# EAGLE schematic MSSRP-Microcontroller (EAGLE 6.6.0)
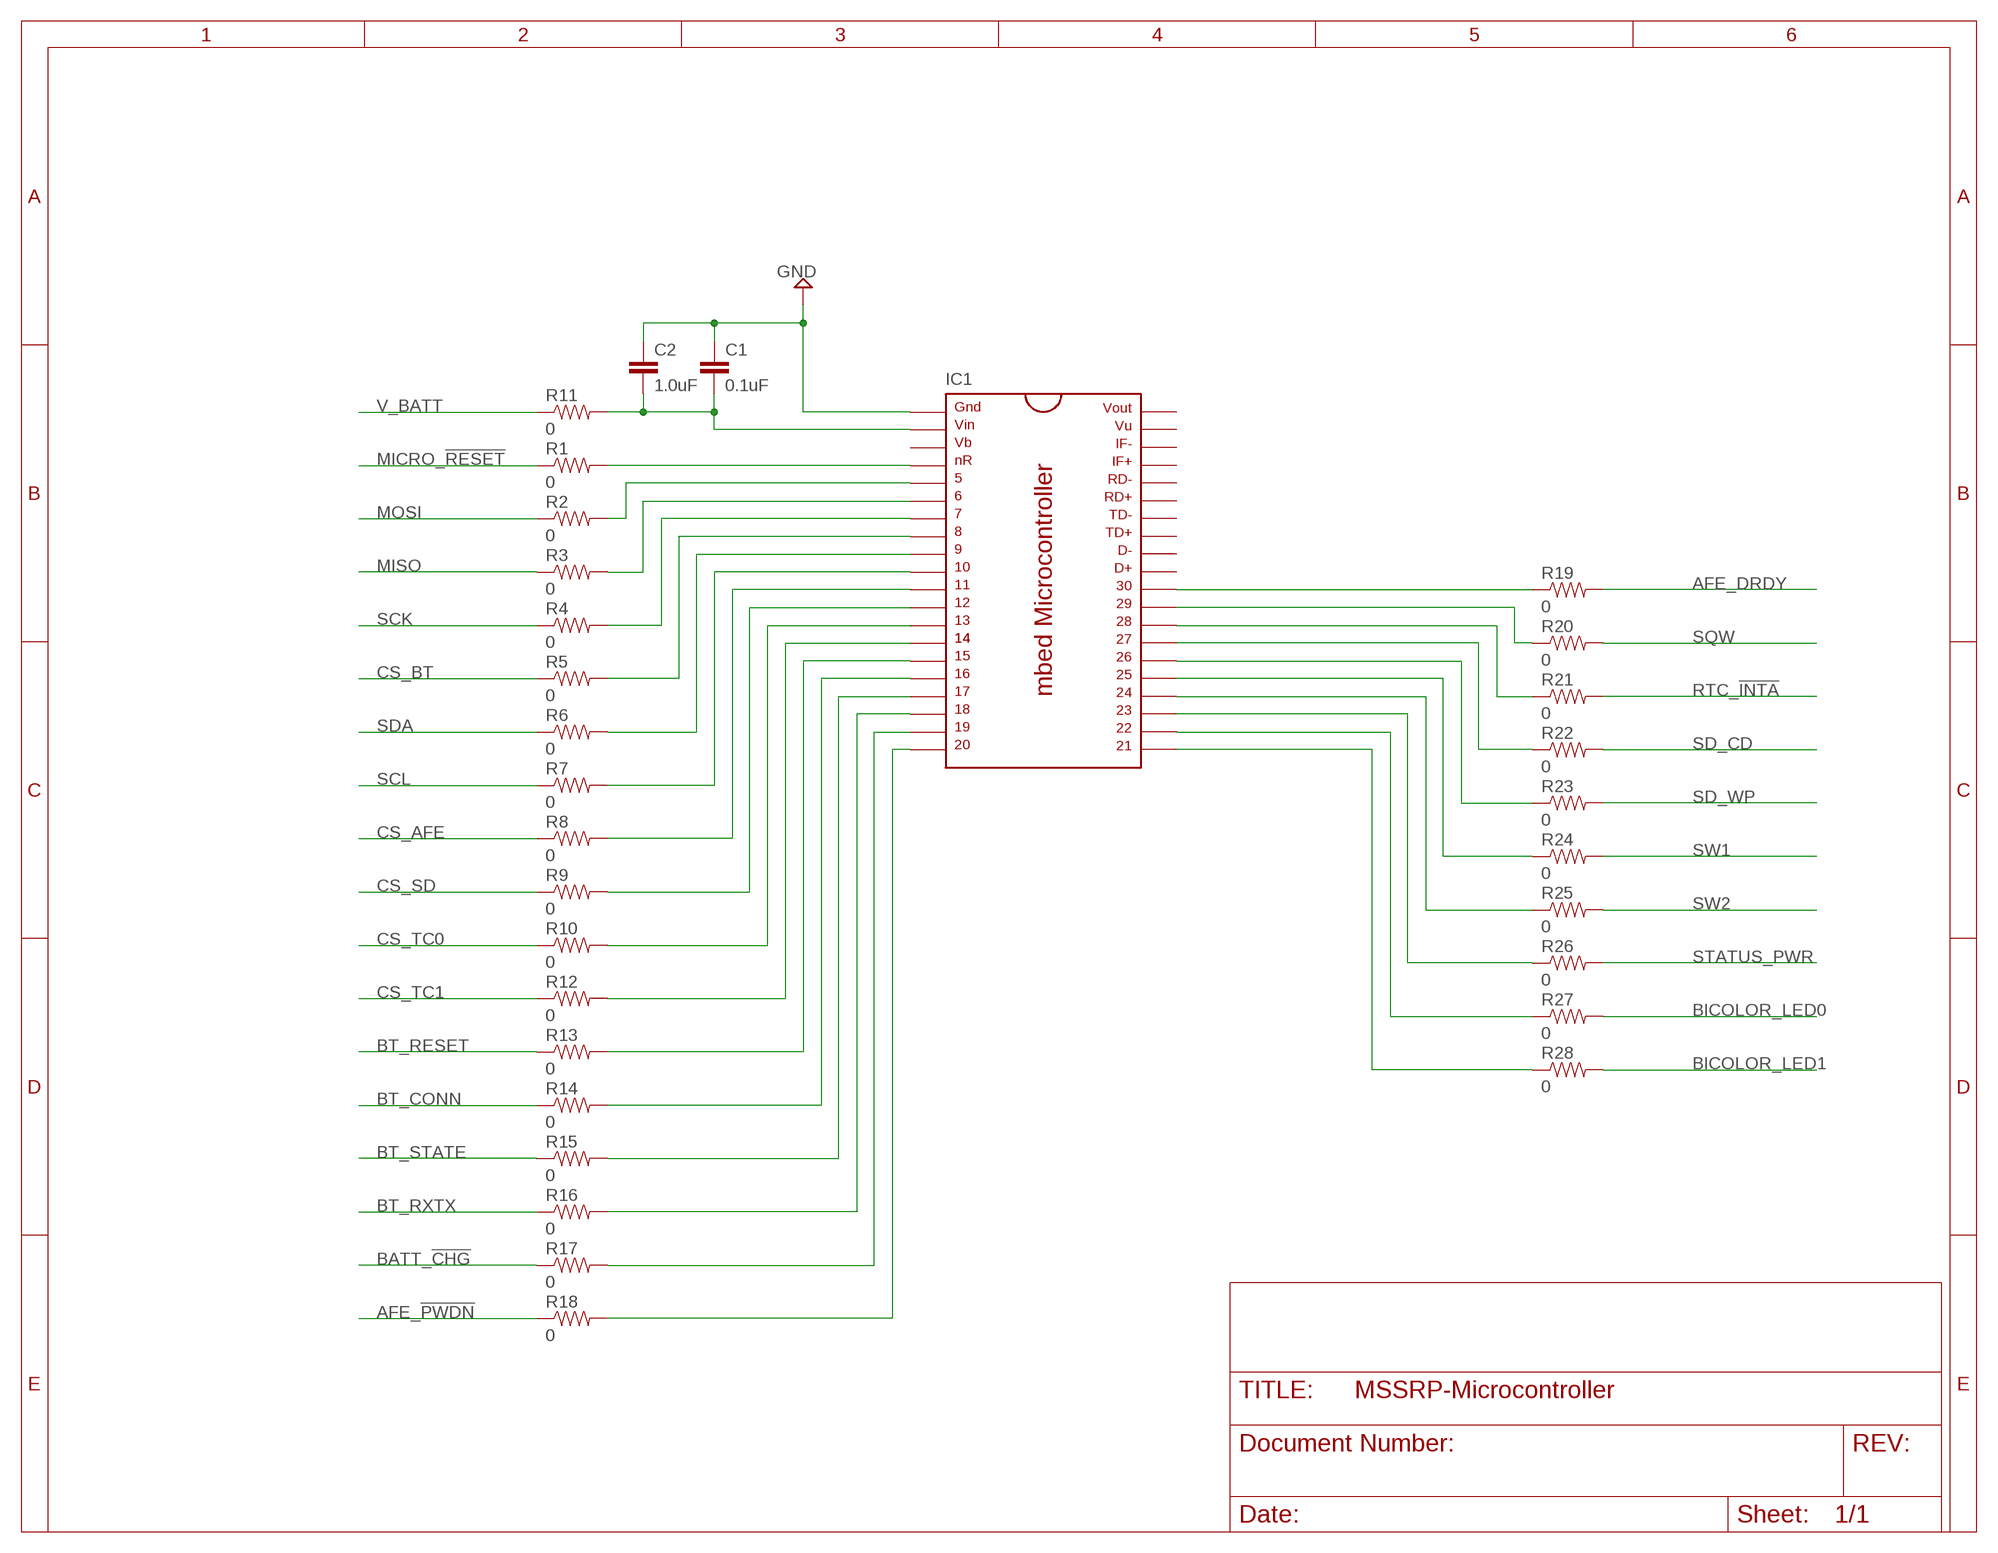
[diagram p0: schematic, sheet 1]

## Parts
C1  0.1uF  0.1UF-25V-5%(0603)  [0603-CAP]
C2  1.0uF  1.0UF-16V-10%(0603)  [0603-CAP]
IC1  MBED  [DIL40_0.9]
R1  0  0OHM1/10W5%(0603)  [0603]
R2  0  0OHM1/10W5%(0603)  [0603]
R3  0  0OHM1/10W5%(0603)  [0603]
R4  0  0OHM1/10W5%(0603)  [0603]
R5  0  0OHM1/10W5%(0603)  [0603]
R6  0  0OHM1/10W5%(0603)  [0603]
R7  0  0OHM1/10W5%(0603)  [0603]
R8  0  0OHM1/10W5%(0603)  [0603]
R9  0  0OHM1/10W5%(0603)  [0603]
R10  0  0OHM1/10W5%(0603)  [0603]
R11  0  0OHM1/10W5%(0603)  [0603]
R12  0  0OHM1/10W5%(0603)  [0603]
R13  0  0OHM1/10W5%(0603)  [0603]
R14  0  0OHM1/10W5%(0603)  [0603]
R15  0  0OHM1/10W5%(0603)  [0603]
R16  0  0OHM1/10W5%(0603)  [0603]
R17  0  0OHM1/10W5%(0603)  [0603]
R18  0  0OHM1/10W5%(0603)  [0603]
R19  0  0OHM1/10W5%(0603)  [0603]
R20  0  0OHM1/10W5%(0603)  [0603]
R21  0  0OHM1/10W5%(0603)  [0603]
R22  0  0OHM1/10W5%(0603)  [0603]
R23  0  0OHM1/10W5%(0603)  [0603]
R24  0  0OHM1/10W5%(0603)  [0603]
R25  0  0OHM1/10W5%(0603)  [0603]
R26  0  0OHM1/10W5%(0603)  [0603]
R27  0  0OHM1/10W5%(0603)  [0603]
R28  0  0OHM1/10W5%(0603)  [0603]

## Nets
AFE_!PWDN: R18.1
AFE_DRDY: R19.2
BATT_!CHG: R17.1
BICOLOR_LED0: R27.2
BICOLOR_LED1: R28.2
BT_CONN: R14.1
BT_RESET: R13.1
BT_RXTX: R16.1
BT_STATE: R15.1
CS_AFE: R8.1
CS_BT: R5.1
CS_SD: R9.1
CS_TC0: R10.1
CS_TC1: R12.1
GND: C1.1 C2.1 IC1.1
MICRO_!RESET: R1.1
MISO: R3.1
MOSI: R2.1
N$1: IC1.4 R1.2
N$2: IC1.5 R2.2
N$3: IC1.6 R3.2
N$4: IC1.7 R4.2
N$5: IC1.8 R5.2
N$6: IC1.9 R6.2
N$7: IC1.10 R7.2
N$8: C1.2 C2.2 IC1.2 R11.2
N$9: IC1.11 R8.2
N$10: IC1.12 R9.2
N$11: IC1.13 R10.2
N$12: IC1.14 R12.2
N$13: IC1.30 R19.1
N$14: IC1.15 R13.2
N$15: IC1.29 R20.1
N$16: IC1.28 R21.1
N$17: IC1.27 R22.1
N$18: IC1.26 R23.1
N$19: IC1.25 R24.1
N$20: IC1.16 R14.2
N$21: IC1.17 R15.2
N$22: IC1.18 R16.2
N$23: IC1.19 R17.2
N$24: IC1.20 R18.2
N$25: IC1.24 R25.1
N$26: IC1.23 R26.1
N$27: IC1.22 R27.1
N$28: IC1.21 R28.1
RTC_!INTA: R21.2
SCK: R4.1
SCL: R7.1
SD_CD: R22.2
SD_WP: R23.2
SDA: R6.1
SQW: R20.2
STATUS_PWR: R26.2
SW1: R24.2
SW2: R25.2
V_BATT: R11.1
Unconnected: IC1.3 IC1.31 IC1.32 IC1.33 IC1.34 IC1.35 IC1.36 IC1.37 IC1.38 IC1.39 IC1.40

## Library data of the parts
C1 = SparkFun-Capacitors:0.1UF-25V-5%(0603): CAP-08604; PROD_ID: CAP-08604
C2 = SparkFun-Capacitors:1.0UF-16V-10%(0603): CAP-00868; PROD_ID: CAP-00868
IC1 = microbuilder:MBED: mbed Microcontroller, DIP40, 0.9"
R1-R28 = SparkFun-Resistors:0OHM1/10W5%(0603): RES-08609; PROD_ID: RES-08609